# Altium schematic sheet IR_Sensor.SchDoc
size A4; SheetNumber: 1; SheetTotal: 1
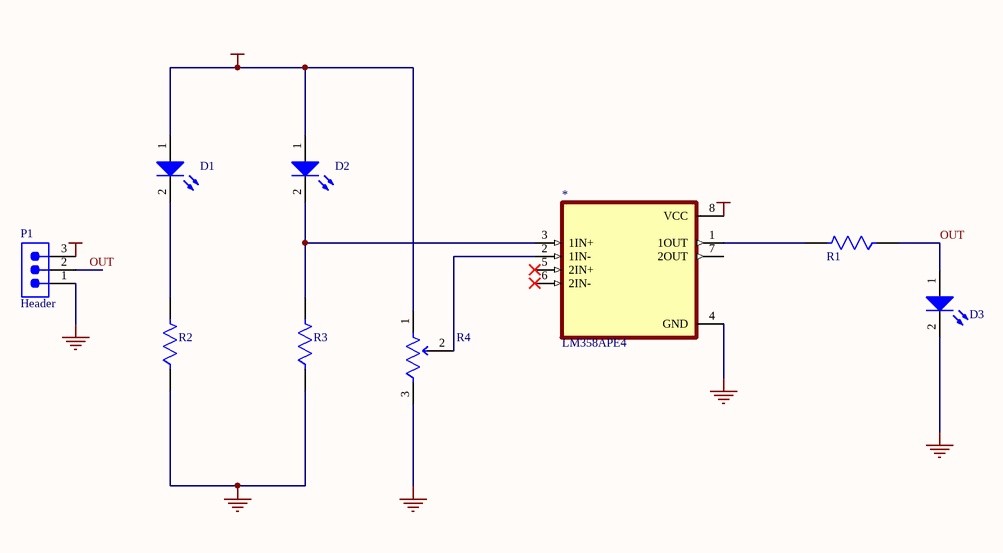
[diagram p0: IR_Sensor.SchDoc]

## Parts
*  LM358APE4  [DIP794W45P254L959H508Q8]
D1  151051BS04000  [WL-TMRC_D5.9H8.7]  (value not drawn)
D2  151051BS04000  [WL-TMRC_D5.9H8.7]  (value not drawn)
D3  151051BS04000  [WL-TMRC_D5.9H8.7]  (value not drawn)
P1  Header  [679303124022]
R1  MRS25000C1002FCT00  [FP-MRS25-MFG]  (value not drawn)
R2  MRS25000C1002FCT00  [FP-MRS25-MFG]  (value not drawn)
R3  MRS25000C1002FCT00  [FP-MRS25-MFG]  (value not drawn)
R4  3386P-1-104LF  [FP-3386P-MFG]  (value not drawn)

## Nets
+5: *.8(VCC) D1.1(A) D2.1(A) P1.3 R4.1(CCW)
GND: *.4(GND) D3.2(K) P1.1 R2.1 R3.1 R4.3(CW)
OUT: D3.1(A) P1.2 R1.1
Net*_1: *.1(1OUT) R1.2
Net*_2: *.2(1IN-) R4.2(WIPER)
Net*_3: *.3(1IN+) D2.2(K) R3.2
NetD1_2: D1.2(K) R2.2

Not connected (* = marked no-connect by the designer): * 5(2IN+)* 6(2IN-)* 7(2OUT)

## Library data of the parts
* = LM358APE4: Operational Amplifier, 2 Func, 5000uV Offset-Max, BIPolar, PDIP8; Manufacturer: Texas Instruments; Package Body Material: Plastic; Architecture: VOLTAGE-FEEDBACK; Average Bias Current-Max (IIB): -200nA; Bias Current-Max (IIB) @25C: 100nA; Common-mode Reject Ratio-Nom: 80dB; Frequency Compensation: YES; Input Offset Voltage-Max: 5mV; Low-Offset: No; Channels: 2; Package Equivalence Code: DIP8,.3; Power Supplies: +-1.5/+-15/3/30V; Slew Rate: 0.3V/µs; Max Supply Current: 2mA; Supply Voltage Limit-Max: 32V; Nominal Supply Voltage: 5V; Surface Mount: No; Unity Gain BW-Nom: 700kHz; Voltage Gain-Min: 15000; Qualification Status: Not Qualified; Supplier: Arrow Electronics; Supplier Part Number: LM358APE4; Manufacturer Part Number: LM358APE4; RoHS: Yes; Category: Amplifiers - Op Amps, Buffer, Instrumentation; Pricing: 1000=0.1345, 2000=0.1331, 3000=0.1318, 4000=0.1305, 5000=0.1292, 6000=0.1279, 10000=0.1266, 20000=0.1253, 50000=0.1241 (USD); Case/Package: DIP; Pins: 8; Package Shape: Rectangular; Terminal Finish: Tin; Min Operating Temperature: 0°C; Max Operating Temperature: 70°C; JESD-609 Code: e3; Amplifier Type: OPERATIONAL AMPLIFIER; JESD-30 Code: R-PDIP-T8; Moisture Sensitivity Level: 1; Package Style: IN-LINEMeter; Packaging: Rail/Tube; Peak Reflow Temperature (Cel): 260°C; Technology: BIPOLAR; Terminal Form: Through Hole; Terminal Position: DUAL; Length: 9.59mm; Width: 7.62mm; Height - Seated (Max): 5.08mm; Terminal Pitch: 2.54mm; Temperature Grade: COMMERCIAL; Reach SVHC Compliant: Yes; RoHS Compliant: Yes; ComponentLink1URL: https://www.ti.com:443/lit/ds/symlink/lm158.pdf?src-supplier=IHS+Markit; ComponentLink1Description: https://www.ti.com:443/lit/ds/symlink/lm158.pdf?src-supplier=IHS+Markit; ComponentLink2URL: https://datasheet.ciiva.com/1811/lm358-1811016.pdf?src-supplier=Digikey; ComponentLink2Description: https://datasheet.ciiva.com/1811/lm358-1811016.pdf?src-supplier=Digikey
D1-D3 = CMP-1488-00009-2: NexarPartId: 29717812; Test Current: 20mA; Forward Voltage: 3.2V; Wavelength: 470nm; Lens Size: 5mm; Lens Style: Circular, Diffused, Round; Forward Current: 100mA; Peak Wavelength: 465nm; Viewing Angle: 40°; Luminous Intensity: 500mcd; Max Reverse Voltage (DC): 5V; Color: Blue; Case/Package: Radial; Width: 5mm; Mount: Through Hole; Min Operating Temperature: -40°C; Length: 5mm; Height: 8.6mm; Max Operating Temperature: 85°C; Packaging: Bulk; RoHS: Compliant; REACH SVHC: Unknown; Dominant Wavelength: 470nm
P1 = CMP-1502-00722-2: NexarPartId: 18818282; Insulation: Insulated; Operating Supply Voltage: 50V; Number of Contacts: 3; Current Rating: 1A; Insulation Resistance: 100MΩ; Gender: Male; Contact Resistance: 20mΩ; Connector Type: Male Pin; Pitch: 1.5mm; Number of Pins: 3; Flammability Rating: UL94 V-0; Lead Pitch: 1.5mm; Max Operating Temperature: 85°C; Contact Plating: Tin; Contact Gender: Male; Height: 5mm; Contact Material: Copper; Mount: Surface Mount; Termination: SMD/SMT; Number of Positions: 3; Color: Beige, White; Length: 7.5mm; Voltage Rating: 50V; Packaging: Tape and Reel; RoHS: Compliant; Housing Material: Nylon; Width: 7.5mm; Number of Rows: 1; Orientation: Vertical; REACH SVHC: No SVHC; Min Operating Temperature: -25°C
R1-R3 = CMP-00030-42632392-1: MRS25000C1002FCT00 Resistor, 10 kOhm, ± 1%, 600 mW, Axial Leaded, Metal Film (Thin Film), Professional; Power Rating: 600mW; Voltage Rating (DC): 350V; Lead Length: 26mm; Resistance: 10kΩ; Temperature Coefficient: 50ppm/°C; Termination: Axial; Number of Terminations: 2; Diameter: 2.5mm; Composition: Metal Film, Thin Film; Number of Pins: 2; Length: 6.5mm; Military Standard: Not; RoHS: Compliant; NexarPartId: 42632392; Width: 2.5mm; Radiation Hardening: No; Voltage Rating: 350V; Max Power Dissipation: 600mW; Min Operating Temperature: -55°C; Lead Free: Lead Free; Max Operating Temperature: 155°C; Tolerance: 1%; Schedule B: 8533210090, 8533210090; Contact Plating: Tin; Mount: Through Hole; REACH SVHC: Unknown; Case/Package: Conformal
R4 = CMP-2000-05592-8: TRIMMER 100K OHM 0.5W PC PIN TOP; Manufacturer Series: 3386; Resistance Law: Linear; Voltage Rating: 300V; Actuator Orientation: Vertical; Tolerance: 10%; Number of Turns: 1; Resistance: 100kR; Number of Terminals/Pins: 3; Temperature Coefficient: 100ppm/°C; Max Power Dissipation: 500mW; Actuator Type: SCREW; Radiation Hardening: No; Package Quantity: 100; Type: Potentiometer; Contact Plating: Tin; RoHS Compliant: Yes; Depth: 9.53mm; Terminal Finish: Tin; Taper: Linear; Color: Blue; Number of Pins: 3; Width: 9.53mm; Lead Free: Contains Lead; Reach SVHC Compliant: Yes; Packaging: Rail/Tube; Min Operating Temperature: -55°C; Max Operating Temperature: 125°C; Technology: CERMET; Height: 4.83mm; Series: Trimpot® 3386 - Sealed; Termination: Pin; Resistance Tolerance: 10%; Power Rating: 500mW; Resistor Type: Cermet; Mount: Through Hole; Military Standard: Not; Length: 9.53mm; Weight: 0.03oz